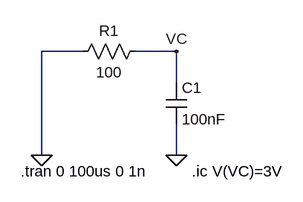
[diagram p0: schematic 02_RC_condicion_inicial.asc]
02_RC_condicion_inicial.asc, the LTspice schematic file:
Version 4
SHEET 1 880 680
WIRE 112 96 48 96
WIRE 256 96 192 96
WIRE 256 144 256 96
WIRE 48 256 48 96
WIRE 256 256 256 208
FLAG 48 256 0
FLAG 256 256 0
FLAG 256 96 VC
SYMBOL cap 240 144 R0
SYMATTR InstName C1
SYMATTR Value 100nF
SYMBOL res 208 80 R90
WINDOW 0 0 56 VBottom 2
WINDOW 3 32 56 VTop 2
SYMATTR InstName R1
SYMATTR Value 100
TEXT 16 280 Left 2 !.tran 0 100us 0 1n
TEXT 280 280 Left 2 !.ic V(VC)=3V

The netlist it stands for:
* 02_RC_condicion_inicial.asc
C1 VC 0 100nF
R1 VC 0 100
.tran 0 100us 0 1n
.ic V(VC)=3V
.backanno
.end